# EAGLE design STM32F05 (EAGLE 7.4.0)
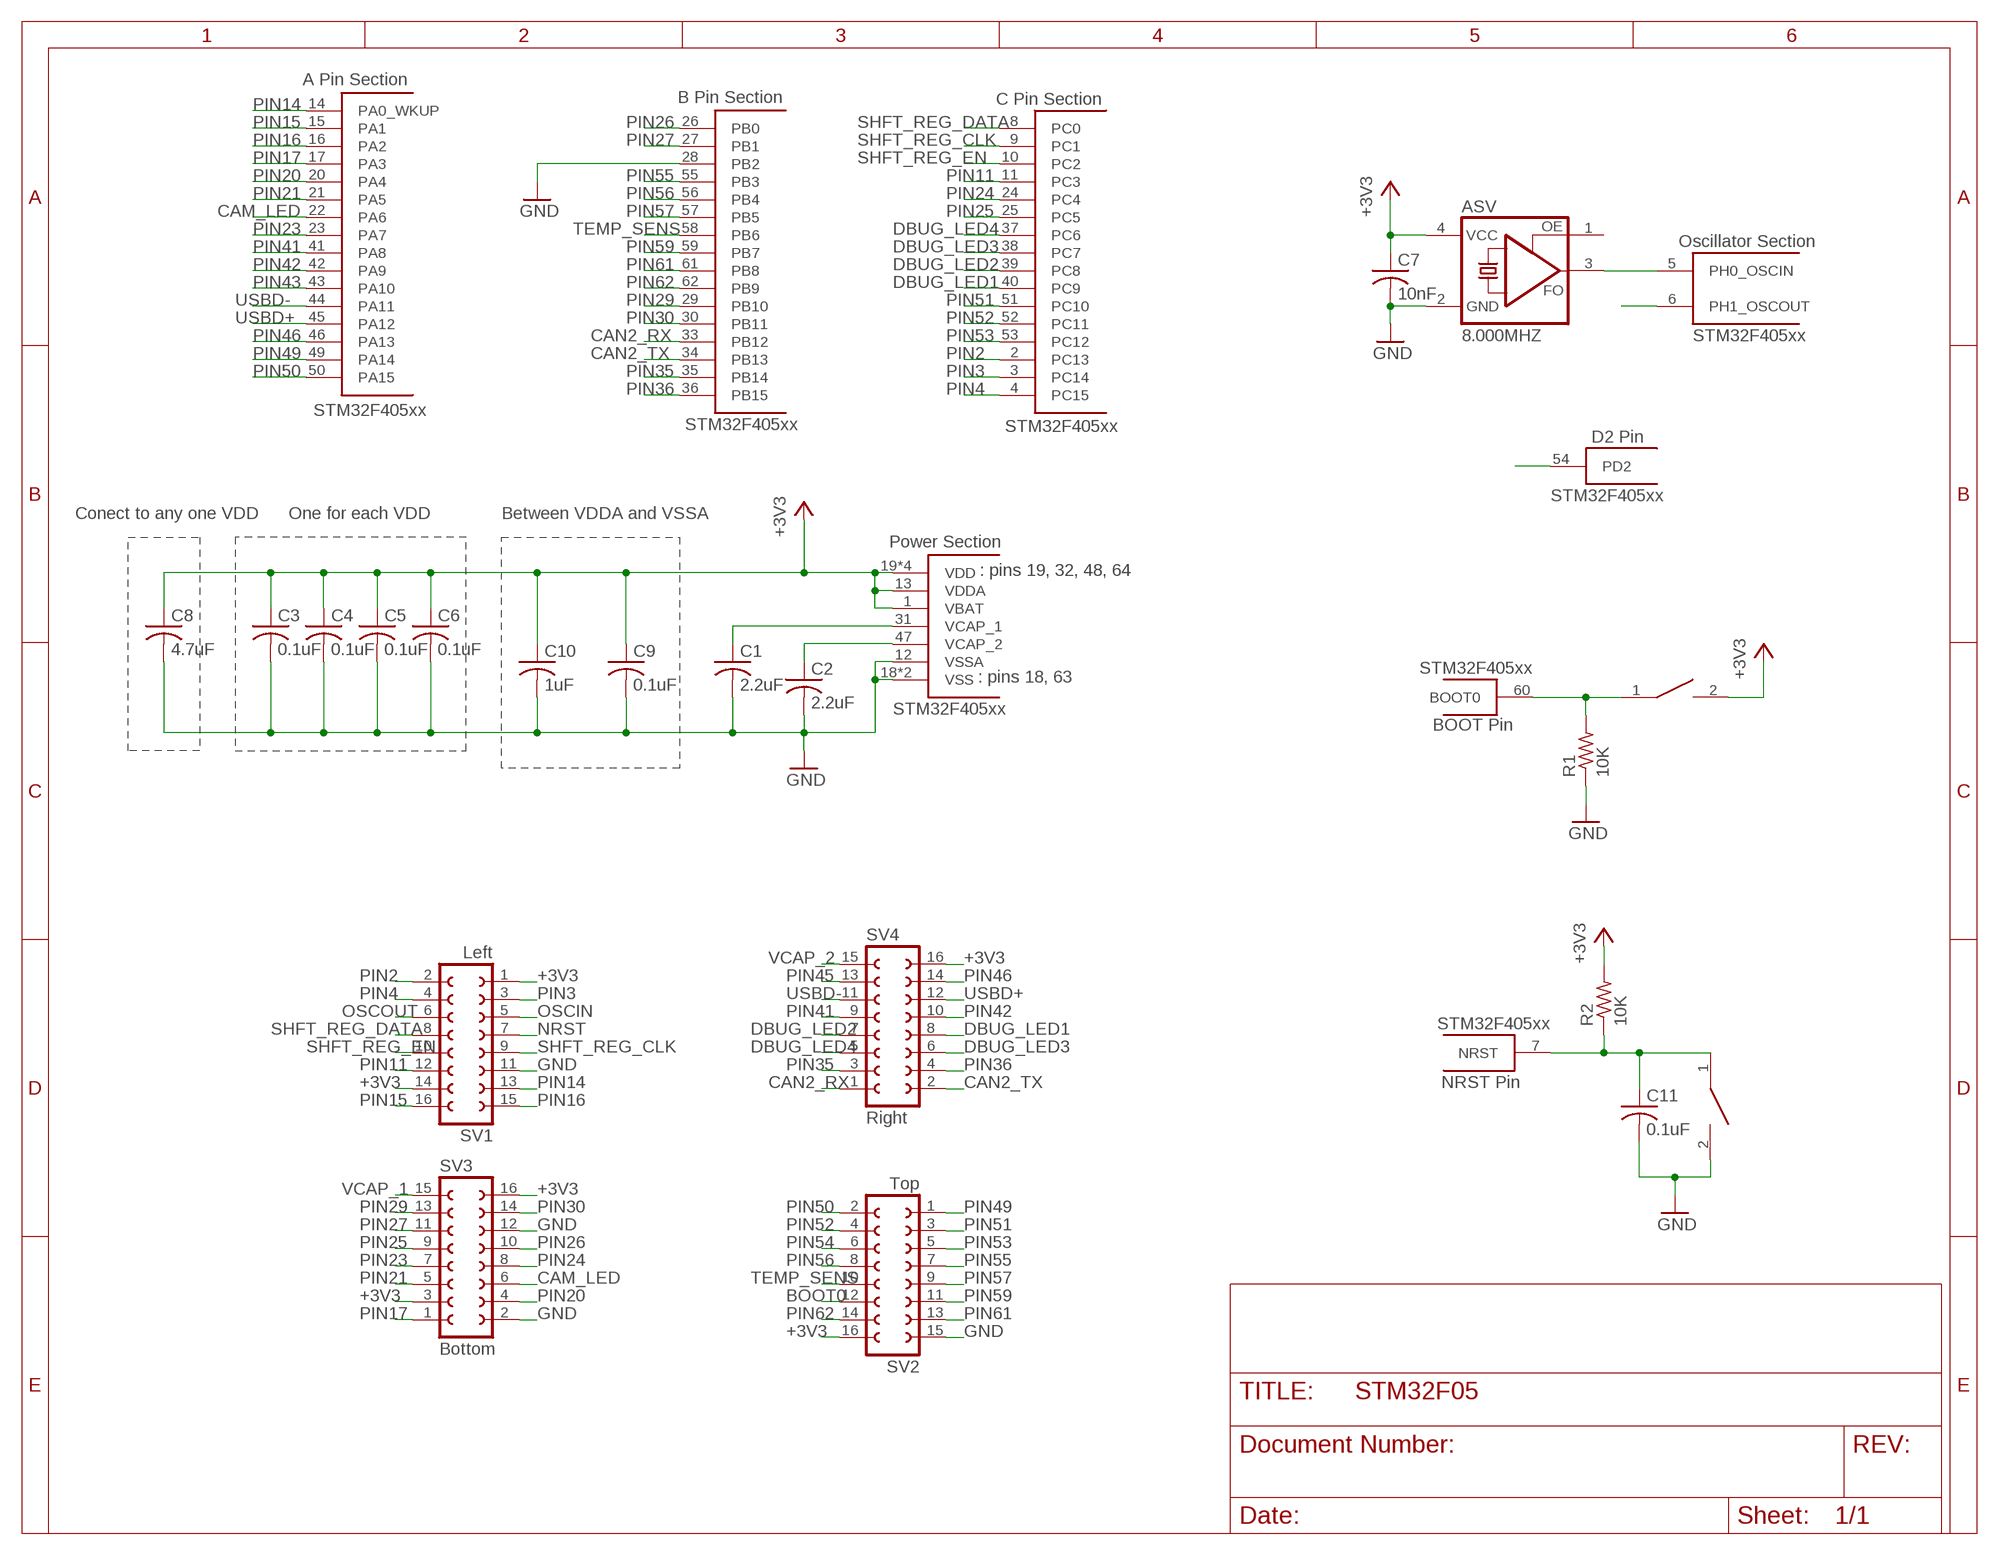
[diagram p0: schematic, sheet 1, part 1 of 2]
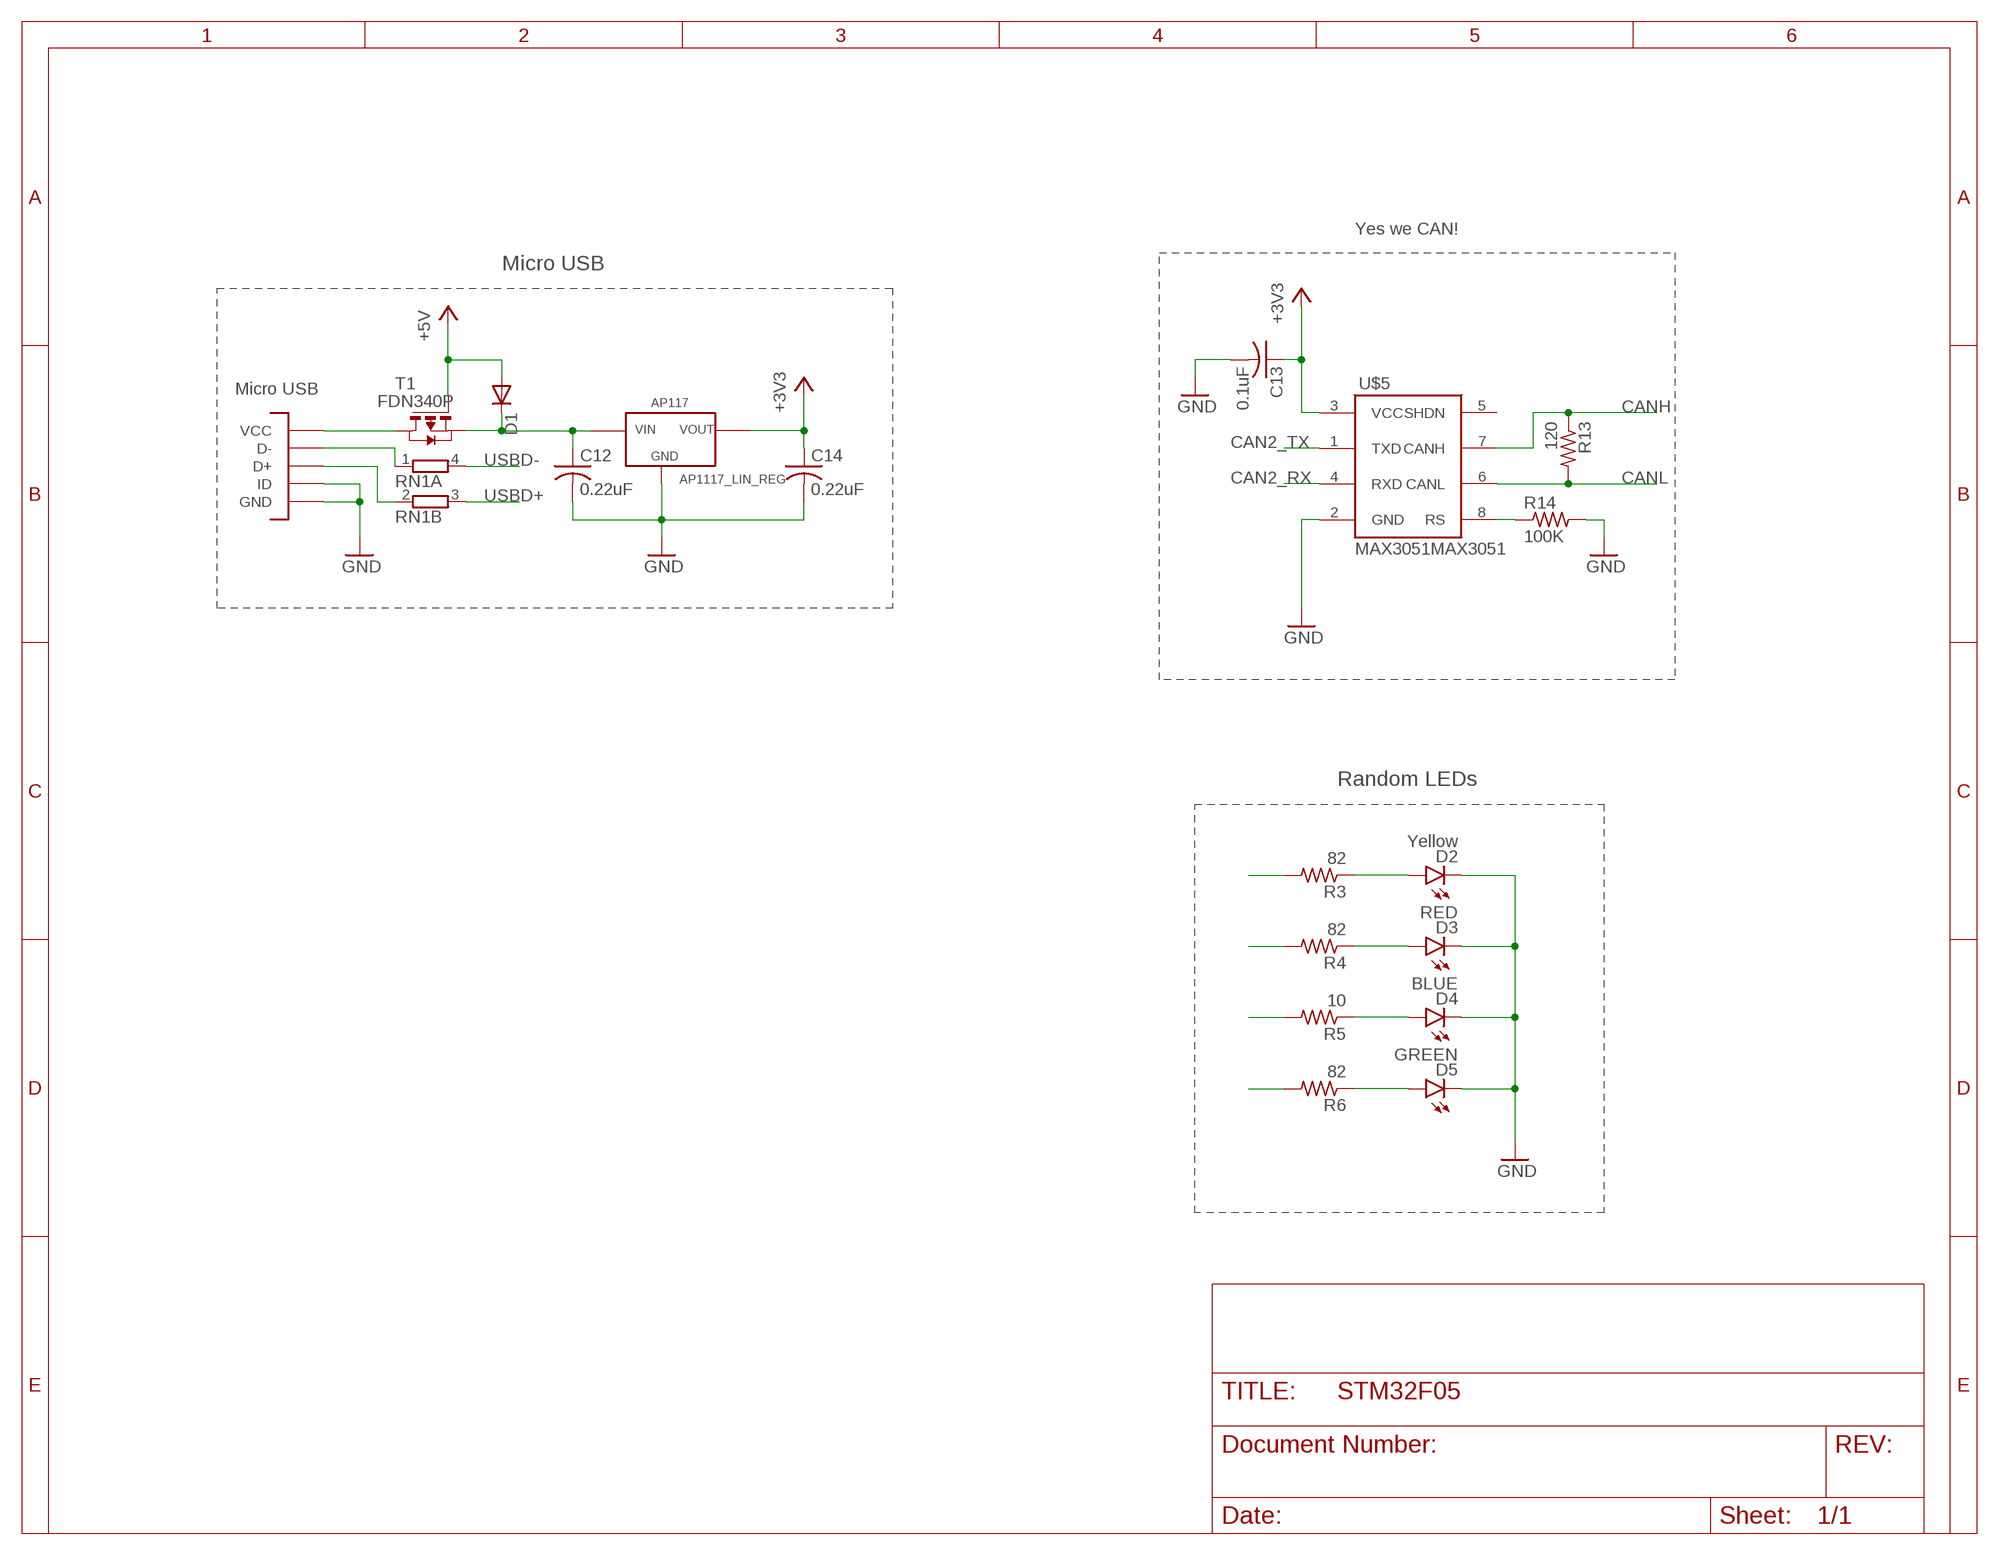
[diagram p1: schematic, sheet 1, part 2 of 2]

## Parts
ASV  8.000MHZ  ASF  [ASF]
C1  2.2uF  C-USC0603  [C0603]
C2  2.2uF  C-USC0603  [C0603]
C3  0.1uF  C-USC0603  [C0603]
C4  0.1uF  C-USC0603  [C0603]
C5  0.1uF  C-USC0603  [C0603]
C6  0.1uF  C-USC0603  [C0603]
C7  10nF  C-USC0603  [C0603]
C8  4.7uF  C-USC0603  [C0603]
C9  0.1uF  C-USC0603  [C0603]
C10  1uF  C-USC0603  [C0603]
C11  0.1uF  C-USC0603  [C0603]
C12  0.22uF  C-USC0603  [C0603]
C13  0.1uF  C-USC0603  [C0603]
C14  0.22uF  C-USC0603  [C0603]
D1  DIODE-DO-214AC  [DO-214AC]
D2  Yellow  LED-YELLOW0603  [LED-0603]
D3  RED  LED-RED0603  [LED-0603]
D4  BLUE  LED-BLUE0603  [LED-0603]
D5  GREEN  LED-GREEN0603  [LED-0603]
R1  10K  R-US_R0603  [R0603]
R2  10K  R-US_R0603  [R0603]
R3  82  R-US_R0603  [R0603]
R4  82  R-US_R0603  [R0603]
R5  10  R-US_R0603  [R0603]
R6  82  R-US_R0603  [R0603]
R13  120  R-US_R0603  [R0603]
R14  100K  R-US_R0603  [R0603]
RN1  2R-NEXBV4V  [EXBV4V]
SV1  Left  FE08-2  [FE08-2]
SV2  Top  FE08-2  [FE08-2]
SV3  Bottom  FE08-2  [FE08-2]
SV4  Right  FE08-2  [FE08-2]
T1  FDN340P  [SOT-23]
T2  AP1117_LIN_REG  [SOT223]
U$1  STM32F405  [LQFP64]
U$2  SWITCH  [SW_2512]
U$3  SWITCH  [SW_2512]
U$4  MICROUSB  [MICRO_B]
U$5  MAX3051MAX3051  [SOT23-8L]

## Nets
+3V3: ASV.4(VCC) C3.1 C4.1 C5.1 C6.1 C7.1 C8.1 C9.1 C10.1 C13.1 C14.1 R2.2 SV1.1 SV1.14 SV2.16 SV3.3 SV3.16 SV4.16 T2.TAB(VOUT) T2.VOUT U$1.1(VBAT) U$1.13(VDDA) U$1.19(VDD) U$1.32(VDD) U$1.48(VDD) U$1.64(VDD) U$2.2 U$5.3(VCC)
+5V: D1.A T1.3(G)
BOOT0: R1.2 SV2.12 U$1.60(BOOT0) U$2.1
CAM_LED: SV3.6 U$1.22(PA6)
CAN2_RX: SV4.1 U$1.33(PB12) U$5.4(RXD)
CAN2_TX: SV4.2 U$1.34(PB13) U$5.1(TXD)
CANH: R13.1 U$5.7(CANH)
CANL: R13.2 U$5.6(CANL)
DBUG_LED1: R3.2 SV4.8 U$1.40(PC9)
DBUG_LED2: R4.2 SV4.7 U$1.39(PC8)
DBUG_LED3: R5.2 SV4.6 U$1.38(PC7)
DBUG_LED4: R6.2 SV4.5 U$1.37(PC6)
GND: ASV.2(GND) C1.2 C2.2 C3.2 C4.2 C5.2 C6.2 C7.2 C8.2 C9.2 C10.2 C11.2 C12.2 C13.2 C14.2 D2.C D3.C D4.C D5.C R1.1 R14.2 SV1.11 SV2.15 SV3.2 SV3.12 T2.GND U$1.12(VSSA) U$1.18(VSS) U$1.28(PB2) U$1.63(VSS) U$3.2 U$4.GND1(GND) U$4.GND2(GND) U$4.GND3(GND) U$4.GND4(GND) U$4.GND7(GND) U$4.GND8(GND) U$4.P4(ID) U$4.P5(GND) U$5.2(GND)
N$1: RN1.1 U$4.P2(D-)
N$24: RN1.2 U$4.P3(D+)
N$57: T1.1(D) U$4.P1(VCC)
N$58: C12.1 D1.C T1.2(S) T2.VIN
N$59: D2.A R3.1
N$60: D3.A R4.1
N$61: D4.A R5.1
N$62: D5.A R6.1
N$63: R14.1 U$5.8(RS)
NRST: C11.1 R2.1 SV1.7 U$1.7(NRST) U$3.1
OSCIN: ASV.3(FO) SV1.5 U$1.5(PH0_OSCIN)
OSCOUT: SV1.6 U$1.6(PH1_OSCOUT)
PIN2: SV1.2 U$1.2(PC13)
PIN3: SV1.3 U$1.3(PC14)
PIN4: SV1.4 U$1.4(PC15)
PIN11: SV1.12 U$1.11(PC3)
PIN14: SV1.13 U$1.14(PA0_WKUP)
PIN15: SV1.16 U$1.15(PA1)
PIN16: SV1.15 U$1.16(PA2)
PIN17: SV3.1 U$1.17(PA3)
PIN20: SV3.4 U$1.20(PA4)
PIN21: SV3.5 U$1.21(PA5)
PIN23: SV3.7 U$1.23(PA7)
PIN24: SV3.8 U$1.24(PC4)
PIN25: SV3.9 U$1.25(PC5)
PIN26: SV3.10 U$1.26(PB0)
PIN27: SV3.11 U$1.27(PB1)
PIN29: SV3.13 U$1.29(PB10)
PIN30: SV3.14 U$1.30(PB11)
PIN35: SV4.3 U$1.35(PB14)
PIN36: SV4.4 U$1.36(PB15)
PIN41: SV4.9 U$1.41(PA8)
PIN42: SV4.10 U$1.42(PA9)
PIN43: U$1.43(PA10)
PIN45: SV4.13
PIN46: SV4.14 U$1.46(PA13)
PIN49: SV2.1 U$1.49(PA14)
PIN50: SV2.2 U$1.50(PA15)
PIN51: SV2.3 U$1.51(PC10)
PIN52: SV2.4 U$1.52(PC11)
PIN53: SV2.5 U$1.53(PC12)
PIN54: SV2.6 U$1.54(PD2)
PIN55: SV2.7 U$1.55(PB3)
PIN56: SV2.8 U$1.56(PB4)
PIN57: SV2.9 U$1.57(PB5)
PIN59: SV2.11 U$1.59(PB7)
PIN61: SV2.13 U$1.61(PB8)
PIN62: SV2.14 U$1.62(PB9)
SHFT_REG_CLK: SV1.9 U$1.9(PC1)
SHFT_REG_DATA: SV1.8 U$1.8(PC0)
SHFT_REG_EN: SV1.10 U$1.10(PC2)
TEMP_SENS: SV2.10 U$1.58(PB6)
USBD+: RN1.3 SV4.12 U$1.45(PA12)
USBD-: RN1.4 SV4.11 U$1.44(PA11)
VCAP_1: C1.1 SV3.15 U$1.31(VCAP_1)
VCAP_2: C2.1 SV4.15 U$1.47(VCAP_2)
Unconnected: ASV.1(OE) U$5.5(SHDN)

## Notes on the sheet
- Yes we CAN!
- Micro USB
- Micro USB
- Conect to any one VDD | One for each VDD | Between VDDA and VSSA
- : pins 19, 32, 48, 64
- : pins 18, 63
- Random LEDs

## Library data of the parts
ASV = DiscreteComponents:ASF*: CRYSTAL CLOCK OSCILLATORS 5.0 Vdc or 3.3 Vdc - LOW PROFILE ULTRA MINIATURE CERAMIC SURFACE MOUNT Source: http://www.abracon.com/Oscillators/asf1-L-L1.pdf; DIGIKEY: 535-10066-1-ND
C1-C14 = rcl:C-US: CAPACITOR, American symbol
D1 = DiscreteComponents:DIODE-: DIODE
D2 = SparkFun-LED:LED-YELLOW: Yellow SMD LEDs LilyPad 1206- DIO-09909 0603- DIO-09003 "SMART" means more efficient and expensive; PROD_ID: DIO-09003
D3 = SparkFun-LED:LED-RED: Assorted Red LEDs LilyPad 1206- DIO-09912 1206- DIO-00809 0603- DIO-00819 "SMART" means more efficient and expensive; PROD_ID: DIO-00819
D4 = SparkFun-LED:LED-BLUE: Blue LEDs for production use Various blue LEDs stocked by SparkFun production 0603 - DIO-08575 Rebel - DIO-09553 1206 - DIO-09911; PROD_ID: DIO-08575
D5 = SparkFun-LED:LED-GREEN: Various green LEDs Green LEDs used in SFE Production 0603- DIO-00821 LARGE- DIO-00862 LILYPAD- DIO-09910; PROD_ID: DIO-00821
R1-R6 R13 R14 = rcl:R-US_: RESISTOR, American symbol
RN1 = DiscreteComponents:2R-N: Array Chip Resistor; DIGIKEY: RHM1381CT-ND; MF: Rohm Semiconductor; MPN: MNR12ERAPJ220
SV1-SV4 = con-lsta:FE08-2: FEMALE HEADER; OC_FARNELL: unknown; OC_NEWARK: unknown
T1 = DiscreteComponents:FDN340P: MOS FET; DIGIKEY: FDN340PCT-ND
T2 = PowerComponents:AP1117_LIN_REG
U$1 = Other:STM32F405
U$2 U$3 = DiscreteComponents:SWITCH
U$4 = Other:MICROUSB
U$5 = MAX3051 Library:MAX3051: Maxim Integrated MAX3051 CAN Tranciever

## Board
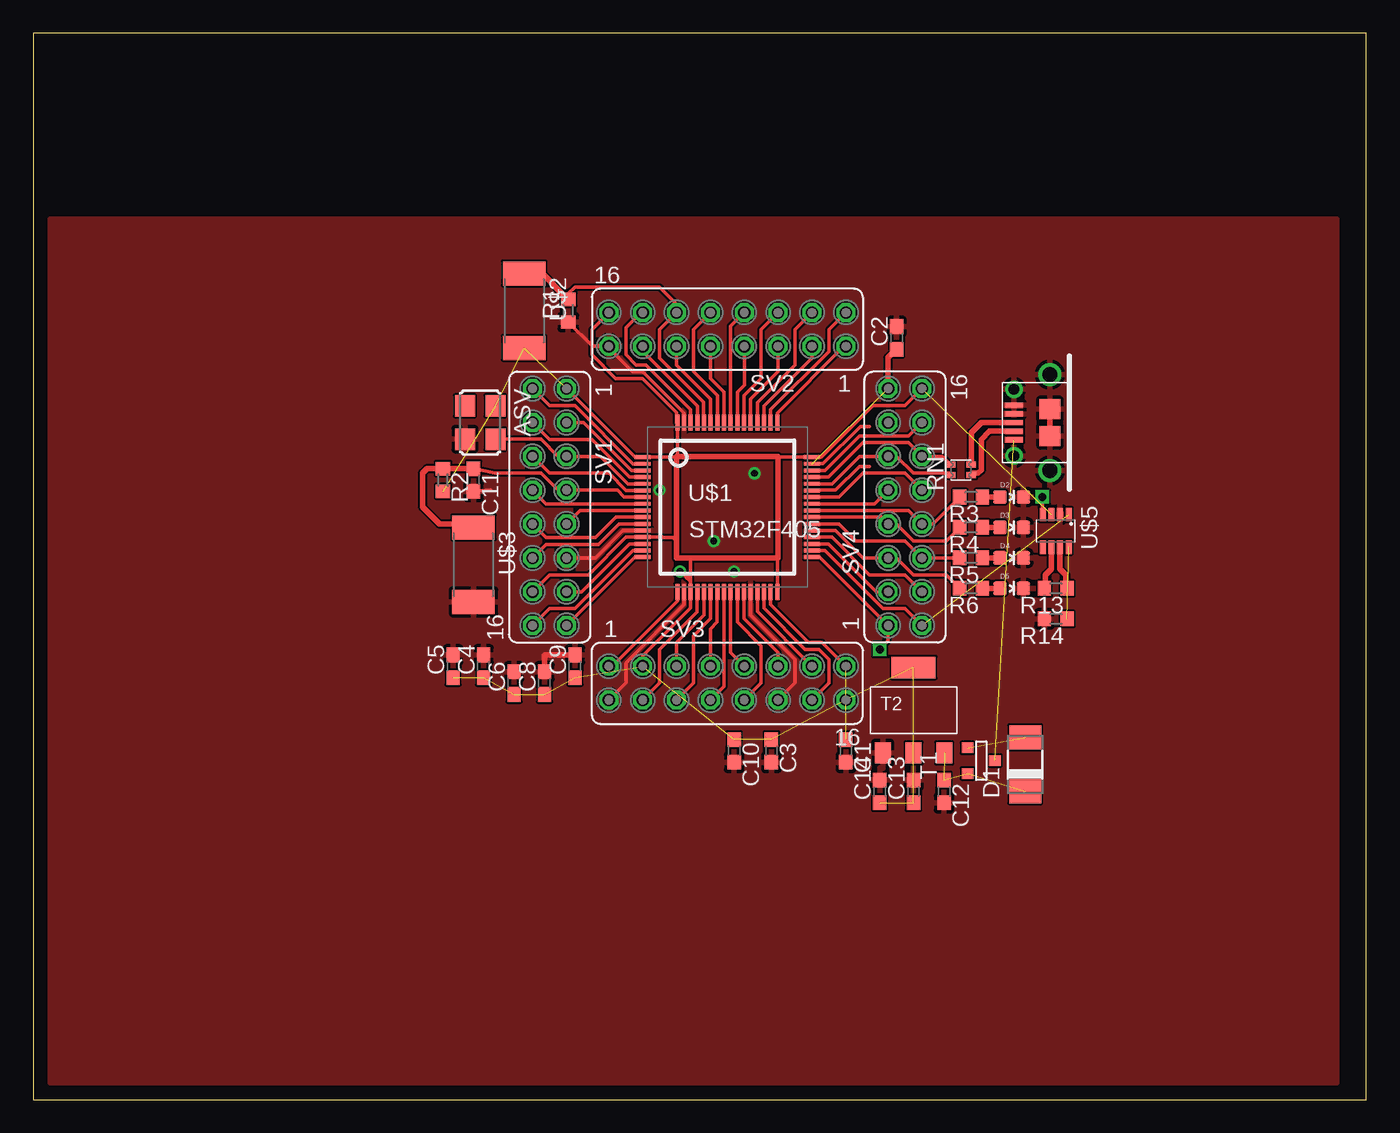
[diagram p2: board, top side]
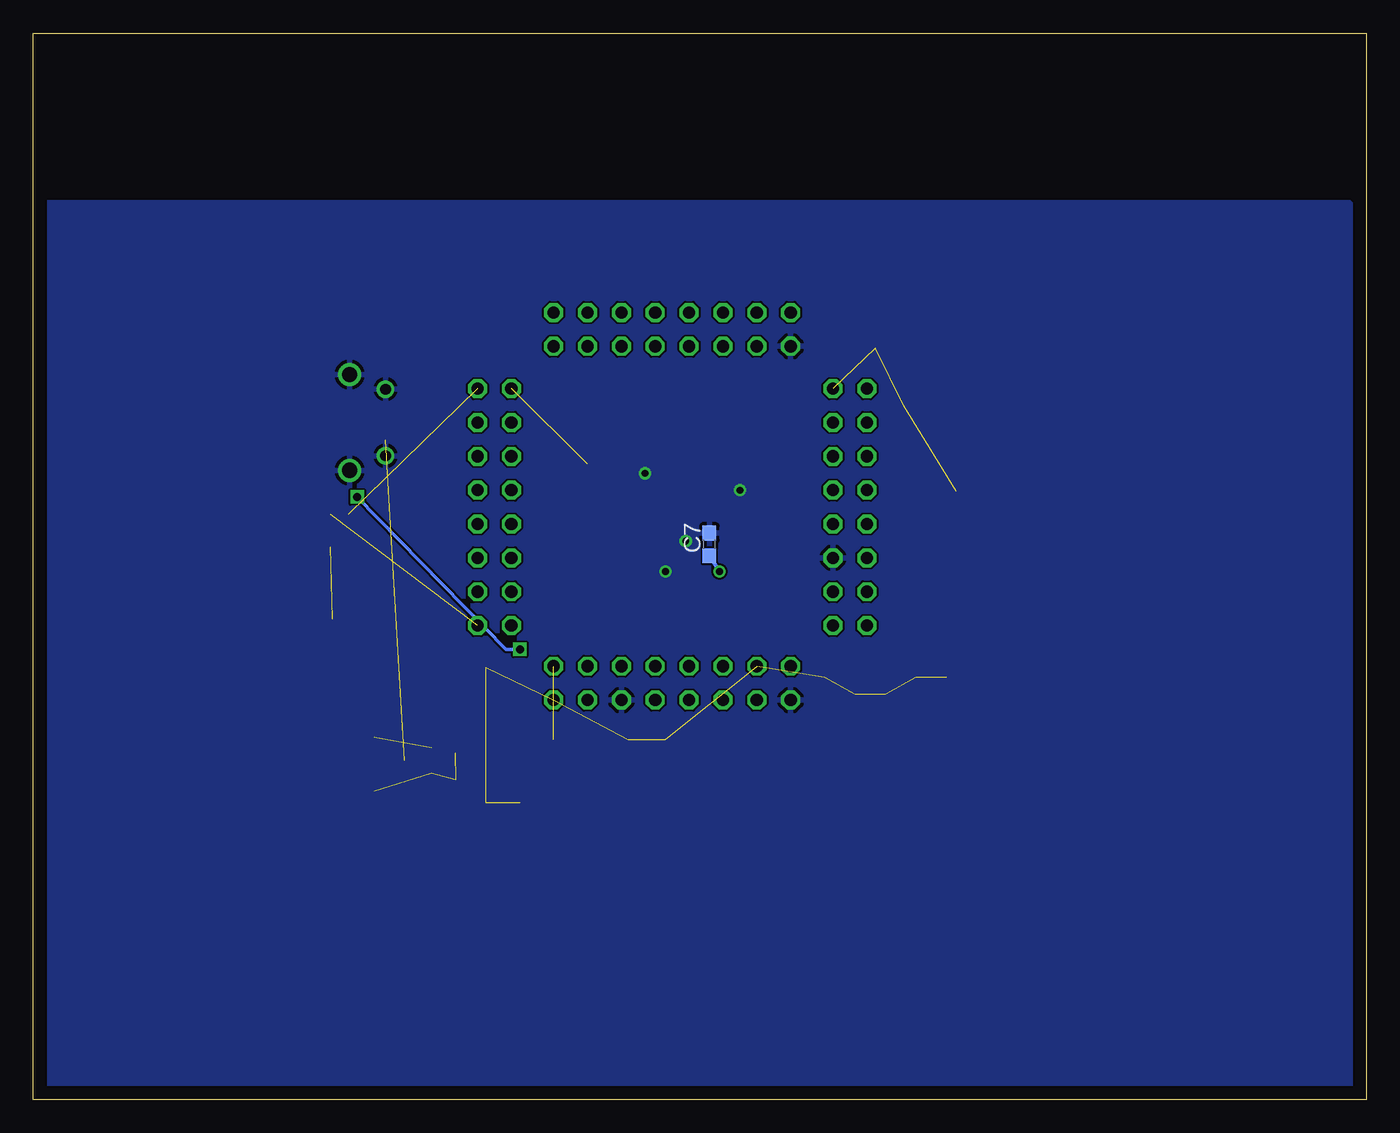
[diagram p3: board, bottom side, seen from below]

Size 100 x 80 mm. Coordinates in mm from the lower left corner, seen from the top.
Outline: 0,0 100,0 100,80 0,80 0,0
Copper layers (1*16): Top 0.035mm / dielectric 1.5mm / Bottom 0.035mm
Design rules "default *": minimum track width 10mil, minimum drill 16mil, track to track 6mil, track to pad 6mil, pad to pad 6mil, via to via 6mil, smd to smd 6mil, copper to edge 40mil, drill to drill 8mil, minimum pad ring 10mil, minimum via ring 8mil, stop-mask expansion 4mil, vias tented up to drill 0mil, thermal gap 10mil

### Footprints (pad centres in the part's own frame; a part is rotated, then mirrored left to right if it is on the bottom)
ASF = smd 1.6 x 1.5: 1 -1.25,-1.15; 2 1.25,-1.15; 3 1.25,1.15; 4 -1.25,1.15
C0603 = smd 1.1 x 1: 1 -0.85,0; 2 0.85,0
DO-214AC = smd 1.8 x 2.4: A 2.025,0; C -2.025,0
LED-0603 = smd 1 x 1: A 0,-0.877; C 0,0.877
R0603 = smd 1 x 1.1: 1 -0.85,0; 2 0.85,0
EXBV4V = smd 0.45 x 0.7: 1 -0.4,-0.775; 2 0.4,-0.775; 3 0.4,0.775; 4 -0.4,0.775
FE08-2 = drill 0.914 octagon: 1 -8.89,1.27; 2 -8.89,-1.27; 3 -6.35,1.27; 4 -6.35,-1.27; 5 -3.81,1.27; 6 -3.81,-1.27; 7 -1.27,1.27; 8 -1.27,-1.27; 9 1.27,1.27; 10 1.27,-1.27; 11 3.81,1.27; 12 3.81,-1.27; 13 6.35,1.27; 14 6.35,-1.27; 15 8.89,1.27; 16 8.89,-1.27
SOT-23 = smd 0.787 x 0.889: 1 0.025,-1.016; 2 -0.94,1.016; 3 0.991,1.016
SOT223 = smd 1.2 x 1.6: GND -2.3,-3.2; VIN 2.3,-3.2; VOUT 0,-3.2 | smd 3.3 x 1.6: TAB 0,3.2
LQFP64 = smd 1.2 x 0.3: 1 -6.35,3.75; 2 -6.35,3.25; 3 -6.35,2.75; 4 -6.35,2.25; 5 -6.35,1.75; 6 -6.35,1.25; 7 -6.35,0.75; 8 -6.35,0.25; 9 -6.35,-0.25; 10 -6.35,-0.75; 11 -6.35,-1.25; 12 -6.35,-1.75; 13 -6.35,-2.25; 14 -6.35,-2.75; 15 -6.35,-3.25; 16 -6.35,-3.75; 33 6.35,-3.75; 34 6.35,-3.25; 35 6.35,-2.75; 36 6.35,-2.25; 37 6.35,-1.75; 38 6.35,-1.25; 39 6.35,-0.75; 40 6.35,-0.25; 41 6.35,0.25; 42 6.35,0.75; 43 6.35,1.25; 44 6.35,1.75; 45 6.35,2.25; 46 6.35,2.75; 47 6.35,3.25; 48 6.35,3.75 | smd 0.3 x 1.2: 17 -3.75,-6.35; 18 -3.25,-6.35; 19 -2.75,-6.35; 20 -2.25,-6.35; 21 -1.75,-6.35; 22 -1.25,-6.35; 23 -0.75,-6.35; 24 -0.25,-6.35; 25 0.25,-6.35; 26 0.75,-6.35; 27 1.25,-6.35; 28 1.75,-6.35; 29 2.25,-6.35; 30 2.75,-6.35; 31 3.25,-6.35; 32 3.75,-6.35; 49 3.75,6.35; 50 3.25,6.35; 51 2.75,6.35; 52 2.25,6.35; 53 1.75,6.35; 54 1.25,6.35; 55 0.75,6.35; 56 0.25,6.35; 57 -0.25,6.35; 58 -0.75,6.35; 59 -1.25,6.35; 60 -1.75,6.35; 61 -2.25,6.35; 62 -2.75,6.35; 63 -3.25,6.35; 64 -3.75,6.35
SW_2512 = smd 1.8 x 3.2: 1 -2.8,0; 2 2.8,0
MICRO_B = smd 1.5 x 1.55: GND1 -1,1.45; GND2 1,1.45 | drill 0.8: GND3 -2.5,4.15; GND4 2.5,4.15 | drill 1.15: GND7 -3.598,1.45; GND8 3.598,1.45 | smd 0.4 x 1.35: P1 -1.3,4.15; P2 -0.65,4.15; P3 0,4.15; P4 0.65,4.15; P5 1.3,4.15
SOT23-8L = smd 0.45 x 1: 1 -0.975,-1.225; 2 -0.325,-1.225; 3 0.325,-1.225; 4 0.975,-1.225; 5 0.975,1.225; 6 0.325,1.225; 7 -0.325,1.225; 8 -0.975,1.225

### Placement (x,y rotation side)
ASV  33.53,50.8 270 top
C1  60.96,26.16 270 top
C2  64.77,57.15 90 top
C3  55.37,26.16 270 top
C4  33.78,32.51 90 top
C5  31.5,32.51 90 top
C6  36.07,31.24 90 top
C7  49.28,41.66 90 bottom
C8  38.35,31.24 90 top
C9  40.64,32.51 90 top
C10  52.58,26.16 270 top
C11  33.02,46.48 270 top
C12  68.33,23.11 270 top
C13  66.04,23.11 90 top
C14  63.5,23.11 90 top
D1  74.42,25.15 90 top
D2  73.41,45.21 270 top
D3  73.41,42.93 270 top
D4  73.41,40.64 270 top
D5  73.41,38.35 270 top
R1  40.13,59.18 90 top
R2  30.73,46.48 270 top
R3  70.36,45.21 180 top
R4  70.36,42.93 180 top
R5  70.36,40.64 180 top
R6  70.36,38.35 180 top
R13  76.71,38.35 180 top
R14  76.71,36.07 180 top
RN1  69.6,47.24 90 top
SV1  38.73,44.45 270 top
SV2  52.07,57.78 180 top
SV3  52.07,31.24 0 top
SV4  65.41,44.45 90 top
T1  71.12,25.4 90 top
T2  66.04,29.21 0 top
U$1  52.07,44.45 0 top
U$2  36.83,59.18 270 top
U$3  33.02,40.13 270 top
U$4  77.72,50.8 90 top
U$5  76.71,42.67 180 top

### Tracks (layer width: path | path; a pad name or v marks a point on that pad's centre or on a via)
+3V3  (via drill 0.51)  (16 unrouted)
  Top 0.254: SV1.1 45.15,48.2 U$1.1 48.2,48.2 48.26,48.26 48.32,48.32 U$1.64 48.26,50.8 48.26,51.56 45.72,54.1 43.69,54.1 41.91,55.88 41.91,57.78 SV2.16 | SV1.14 38.73,39.37 41.66,39.37 44.49,42.2 U$1.13 47.21,42.2 47.24,42.16 48.01,42.16 48.26,41.91 | SV4.16 65.41,52.07 62.99,52.07 59.12,48.2 U$1.48 55.94,48.2 55.88,48.26 | SV3.3 45.72,33.27 49.32,36.87 U$1.19 49.32,38.86 | 49.32,38.86 49.32,40.43 49.53,40.64 | U$1.32 55.82,40.58 55.88,40.64 | v48.51,39.62 49.32,38.86
  Top 0.406: 48.26,48.26 55.88,48.26 55.88,40.64 49.53,40.64 48.26,40.64 48.26,41.91 48.26,48.26
  Bottom 0.254: C7.1 v48.51,39.62
+5V  (1 unrouted)
BOOT0
  Top 0.254: U$1.60 50.32,51.03 50.29,51.05 50.29,52.32 46.99,55.63 46.99,57.78 SV2.12 48.26,59.69 46.99,60.96 40.64,60.96 40.13,60.45 R1.2
  Top 0.406: U$2.1 36.83,62.23 37.93,62.23 R1.2
CAM_LED
  Top 0.254: U$1.22 50.82,36.09 49.53,34.8 49.53,31.24 SV3.6
CAN2_RX  (via drill 0.6)
  Top 0.254: U$1.33 58.99,40.7 SV4.1 64.14,34.42 v63.5,33.78 | v75.69,45.21 75.69,43.94 U$5.4
  Bottom 0.254: v63.5,33.78 64.52,33.78 v75.69,45.21
CAN2_TX  (1 unrouted)
  Top 0.254: U$1.34 59.38,41.2 63.75,36.83 65.41,36.83 SV4.2
CANH
  Top 0.406: U$5.7 77.03,39.81 77.47,39.37 77.47,38.44 R13.1
CANL
  Top 0.406: U$5.6 76.38,39.81 75.95,39.37 75.95,38.44 R13.2
DBUG_LED1
  Top 0.254: U$1.40 65.66,44.2 SV4.8 67.48,43.18 R3.2
DBUG_LED2
  Top 0.254: U$1.39 63.62,43.7 SV4.7 64.77,43.18 66.04,41.91 68.49,41.91 R4.2
DBUG_LED3
  Top 0.254: U$1.38 60.43,43.2 61.72,41.91 65.41,41.91 SV4.6 R5.2
DBUG_LED4
  Top 0.254: U$1.37 60.17,42.7 62.23,40.64 SV4.5 64.77,40.64 66.04,39.37 68.49,39.37 R6.2
GND  (via drill 0.51)
  Top 0.254: SV1.11 42.16,40.64 44.22,42.7 U$1.12 | U$1.63 48.82,51.51 45.72,54.61 44.96,54.61 43.18,56.39 SV2.15 41.95,56.52 R1.1 | U$1.18 48.82,37.14 44.45,32.77 44.45,31.24 SV3.2 | U$1.28 53.82,36.35 57.15,33.02 57.15,31.24 SV3.12 | C11.2 34.29,45.72
  Top 0.406: 74.17,38.24 D5.C | 76.2,49.53 76.2,49.8 U$4.GND1 U$4.GND2 | C8.2 38.35,33.36 C9.2
  other vias: 46.99,45.72 52.58,39.62 54.1,46.99 51.05,41.91
  pour Bottom: 1.27,67.31 99.06,67.31 99.06,0 0,0 0,66.04
  pour Top: 1.27,66.04 97.79,66.04 97.79,1.27 1.27,1.27
N$1
  Top 0.406: U$4.P2 71.74,50.15 71.12,49.53 71.12,47.24 70.87,46.99 70.52,46.99 RN1.1
N$2
  Top 0.254: 58.42,45.72 60.2,45.72 61.98,47.5 62.74,47.5
N$3
  Top 0.254: 58.65,47.7 59.26,47.7 62.05,50.49 62.74,50.49
N$4
  Top 0.254: 49.02,39.12 49.28,39.37
N$24
  Top 0.406: RN1.2 70.37,50.05 71.12,50.8 U$4.P3
N$57  (1 unrouted)
N$58  (3 unrouted)
N$59
  Top 0.406: D2.A R3.1
N$60
  Top 0.406: D3.A R4.1
N$61
  Top 0.406: D4.A R5.1
N$62
  Top 0.406: D5.A R6.1
N$63  (1 unrouted)
NRST
  Top 0.254: U$1.7 44.34,45.2 43.81,45.72 SV1.7 39.37,45.72 38.1,46.99 34.63,46.99 C11.1
  Top 0.406: C11.1 R2.1 29.55,47.33 29.21,46.99 29.21,44.45 30.48,43.18 32.77,43.18 U$3.1
OSCIN
  Top 0.254: U$1.5 44.6,46.2 42.55,48.26 SV1.5 39.37,48.26 38.08,49.55 ASV.3
OSCOUT
  Top 0.254: U$1.6 44.47,45.7 43.18,46.99 38.73,46.99 SV1.6
PIN2
  Top 0.254: U$1.2 45.01,47.7 40.64,52.07 38.73,52.07 SV1.2
PIN3
  Top 0.254: U$1.3 44.88,47.2 41.27,50.8 SV1.3
PIN4
  Top 0.254: U$1.4 44.74,46.7 41.91,49.53 38.73,49.53 SV1.4
PIN11
  Top 0.254: SV1.12 38.48,41.66 42.42,41.66 43.96,43.2 U$1.11
PIN14
  Top 0.254: U$1.14 44.75,41.7 41.15,38.1 SV1.13
PIN15
  Top 0.254: U$1.15 45.01,41.2 40.64,36.83 38.73,36.83 SV1.16
PIN16
  Top 0.254: U$1.16 45.15,40.7 SV1.15
PIN17
  Top 0.254: U$1.17 48.32,37.4 43.69,32.77 43.43,32.77 SV3.1
PIN20
  Top 0.254: U$1.20 49.82,37.63 49.78,37.59 49.78,36.58 46.99,33.78 46.99,31.24 SV3.4
PIN21
  Top 0.254: U$1.21 50.32,36.35 48.26,34.29 SV3.5
PIN23
  Top 0.254: U$1.23 51.32,37.6 51.31,37.59 51.31,35.81 50.8,35.31 SV3.7
PIN24
  Top 0.254: U$1.24 51.82,30.99 SV3.8
PIN25
  Top 0.254: U$1.25 52.32,33.53 SV3.9
PIN26
  Top 0.254: U$1.26 52.82,35.83 54.61,34.04 54.61,31.24 SV3.10
PIN27
  Top 0.254: U$1.27 53.32,36.09 55.88,33.53 SV3.11
PIN29
  Top 0.254: U$1.29 54.32,36.61 SV3.13
PIN30
  Top 0.254: U$1.30 54.82,36.87 57.91,33.78 58.93,33.78 59.69,33.02 59.69,31.24 SV3.14
PIN35
  Top 0.254: U$1.35 59.65,41.7 63.25,38.1 SV4.3
PIN36
  Top 0.254: U$1.36 59.91,42.2 62.74,39.37 65.41,39.37 SV4.4
PIN41
  Top 0.254: U$1.41 63.12,44.7 SV4.9
PIN42
  Top 0.254: U$1.42 60.44,45.2 62.23,46.99 65.41,46.99 SV4.10
PIN46
  Top 0.254: U$1.46 59.39,47.2 61.98,49.78 65.66,49.78 SV4.14
PIN49
  Top 0.254: U$1.49 55.82,51.5 60.83,56.52 SV2.1
PIN50
  Top 0.254: U$1.50 55.32,51.76 59.69,56.13 59.69,57.78 SV2.2
PIN51
  Top 0.254: U$1.51 54.82,52.03 58.42,55.63 SV2.3
PIN52
  Top 0.254: U$1.52 54.32,52.29 57.15,55.12 57.15,57.78 SV2.4
PIN53
  Top 0.254: U$1.53 53.82,52.55 55.88,54.61 SV2.5
PIN54
  Top 0.254: U$1.54 53.32,52.81 54.61,54.1 54.61,57.78 SV2.6
PIN55
  Top 0.254: U$1.55 52.82,53.07 53.34,53.59 SV2.7
PIN56
  Top 0.254: U$1.56 52.32,58.03 SV2.8
PIN57
  Top 0.254: U$1.57 51.82,53.08 50.8,54.1 SV2.9
PIN59
  Top 0.254: U$1.59 50.82,52.56 48.26,55.12 SV2.11
PIN61
  Top 0.254: U$1.61 49.82,52.03 45.97,55.88 45.97,56.26 SV2.13
PIN62
  Top 0.254: U$1.62 49.32,51.77 45.97,55.12 45.21,55.12 44.45,55.88 44.45,57.91 45.59,59.05 SV2.14
SHFT_REG_CLK
  Top 0.254: SV1.9 41.02,44.2 U$1.9
SHFT_REG_DATA
  Top 0.254: U$1.8 38.48,44.7 SV1.8
SHFT_REG_EN
  Top 0.254: SV1.10 38.48,42.16 42.16,42.16 43.7,43.7 U$1.10
TEMP_SENS
  Top 0.254: U$1.58 51.32,52.82 49.53,54.61 49.53,57.78 SV2.10
USBD+
  Top 0.254: U$1.45 59.65,46.7 62.23,49.28 65.66,49.28 SV4.12 68.2,48.26 RN1.3
USBD-
  Top 0.254: U$1.44 59.92,46.2 61.98,48.26 SV4.11 64.77,48.26 66.04,46.99 68.67,46.99 RN1.4
VCAP_1  (1 unrouted)
  Top 0.254: U$1.31 55.32,37.14 58.17,34.29 59.18,34.29 SV3.15
VCAP_2  (1 unrouted)
  Top 0.406: SV4.15 64.14,55.66 C2.1